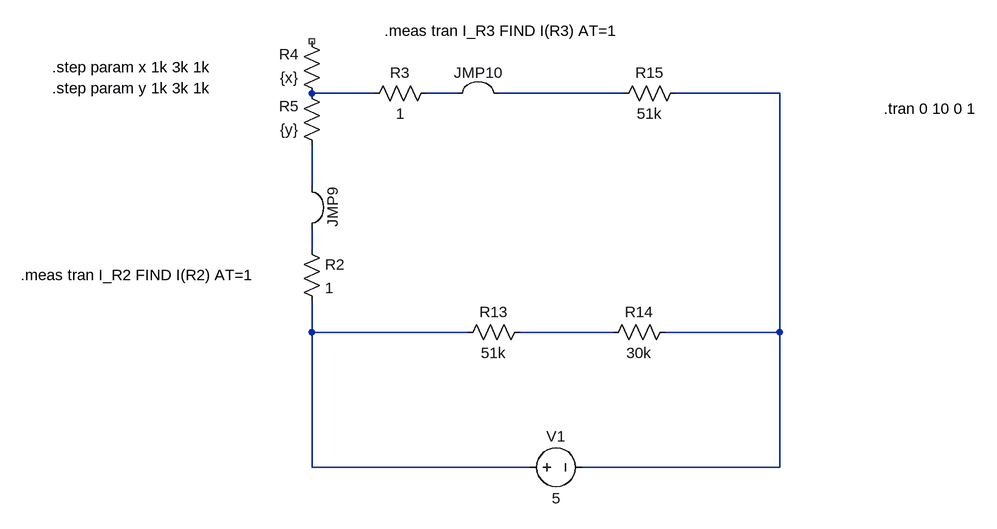
[diagram p0: schematic Draft2.asc]
Draft2.asc, the LTspice schematic file:
Version 4.1
SHEET 1 880 680
WIRE -160 -16 -256 -16
WIRE -32 -16 -80 -16
WIRE 224 -16 32 -16
WIRE 464 -16 304 -16
WIRE -256 128 -256 64
WIRE -256 224 -256 192
WIRE -256 352 -256 304
WIRE -16 352 -256 352
WIRE 208 352 64 352
WIRE 464 352 464 -16
WIRE 464 352 288 352
WIRE -256 560 -256 352
WIRE 80 560 -256 560
WIRE 464 560 464 352
WIRE 464 560 160 560
SYMBOL res 320 -32 R90
WINDOW 0 0 56 VBottom 2
WINDOW 3 32 56 VTop 2
SYMATTR InstName R15
SYMATTR Value 51k
SYMBOL res 80 336 R90
WINDOW 0 0 56 VBottom 2
WINDOW 3 32 56 VTop 2
SYMATTR InstName R13
SYMATTR Value 51k
SYMBOL res 304 336 R90
WINDOW 0 0 56 VBottom 2
WINDOW 3 32 56 VTop 2
SYMATTR InstName R14
SYMATTR Value 30k
SYMBOL res -240 0 R180
WINDOW 0 36 76 Left 2
WINDOW 3 36 40 Left 2
SYMATTR InstName R4
SYMATTR Value {x}
SYMBOL res -240 80 R180
WINDOW 0 36 76 Left 2
WINDOW 3 36 40 Left 2
SYMATTR InstName R5
SYMATTR Value {y}
SYMBOL voltage 64 560 R270
WINDOW 0 32 56 VTop 2
WINDOW 3 -32 56 VBottom 2
WINDOW 123 0 0 Left 0
WINDOW 39 0 0 Left 0
SYMATTR InstName V1
SYMATTR Value 5
SYMBOL Misc\\jumper 0 -80 R0
SYMATTR InstName JMP10
SYMBOL Misc\\jumper -192 160 R90
SYMATTR InstName JMP9
SYMBOL res -272 208 R0
SYMATTR InstName R2
SYMATTR Value 1
SYMBOL res -64 -32 R90
WINDOW 0 0 56 VBottom 2
WINDOW 3 32 56 VTop 2
SYMATTR InstName R3
SYMATTR Value 1
TEXT -656 -56 Left 2 !.step param x 1k 3k 1k
TEXT -656 -24 Left 2 !.step param y 1k 3k 1k
TEXT -144 -112 Left 2 !.meas tran I_R3 FIND I(R3) AT=1
TEXT -704 264 Left 2 !.meas tran I_R2 FIND I(R2) AT=1
TEXT 624 8 Left 2 !.tran 0 10 0 1

The netlist it stands for:
* Draft2.asc
R15 N003 N002 51k
R13 N006 N005 51k
R14 N003 N006 30k
R4 N001 NC_01 {x}
R5 N004 N001 {y}
V1 N005 N003 5
R2 N004 N005 1
R3 N002 N001 1
.step param x 1k 3k 1k
.step param y 1k 3k 1k
.meas tran I_R3 FIND I(R3) AT=1
.meas tran I_R2 FIND I(R2) AT=1
.tran 0 10 0 1
.backanno
.end